# Altium schematic sheet Octal Flash.SchDoc
size A4; SheetNumber: 3; SheetTotal: 6
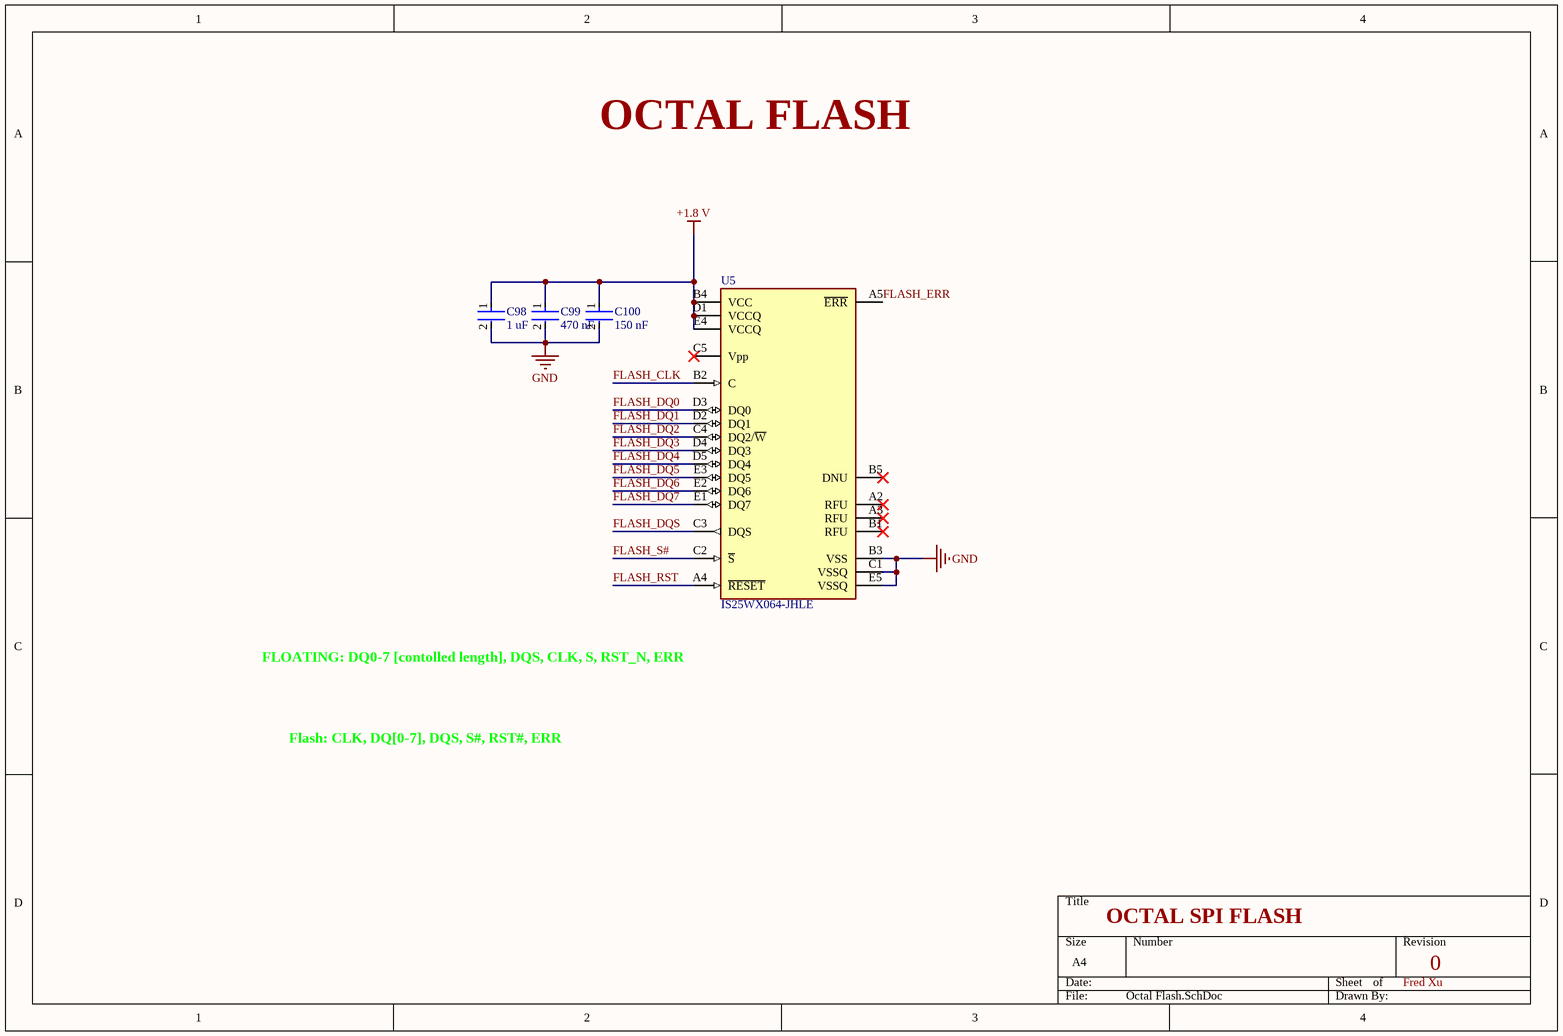
[diagram p0: Octal Flash.SchDoc]

## Parts
C98  1 uF  [FP-GCM155-0_2-MFG]
C99  470 nF  [FP-GRM155-0_05-IPC_B]
C100  150 nF  [FP-GCM155-0_05-MFG]
U5  IS25WX064-JHLE  [FP-IS25WX064-JHLE-IPC_A]

## Nets
+1.8 V: C98.1 C99.1 C100.1 U5.B4(VCC) U5.D1(VCCQ) U5.E4(VCCQ)
GND: C98.2 C99.2 C100.2 U5.B3(VSS) U5.C1(VSSQ) U5.E5(VSSQ)
FLASH_CLK: U5.B2(C)
FLASH_DQ0: U5.D3(DQ0)
FLASH_DQ1: U5.D2(DQ1)
FLASH_DQ2: U5.C4(DQ2/~{W})
FLASH_DQ3: U5.D4(DQ3)
FLASH_DQ4: U5.D5(DQ4)
FLASH_DQ5: U5.E3(DQ5)
FLASH_DQ6: U5.E2(DQ6)
FLASH_DQ7: U5.E1(DQ7)
FLASH_DQS: U5.C3(DQS)
FLASH_ERR: U5.A5(~{ERR})
FLASH_RST: U5.A4(~{RESET})
FLASH_S#: U5.C2(~{S})

Not connected (* = marked no-connect by the designer): U5 A2(RFU)* A3(RFU)* B1(RFU)* B5(DNU)* C5(Vpp)*

## Notes on the sheet
- OCTAL FLASH
- FLOATING: DQ0-7 [contolled length], DQS, CLK, S, RST_N, ERR
- Flash: CLK, DQ[0-7], DQS, S#, RST#, ERR
- OCTAL SPI FLASH
- Fred Xu
- 0

## Library data of the parts
C98 = CMP-06035-019453-1: Ceramic Capacitor for Automotive 1uF ±20% 10VDC X7S 0402 Paper T/R
C99 = CMP-06035-008909-1: Chip Multilayer Ceramic Capacitors for General Purpose, 0402, 0.47uF, X7R, 15%, 20%, 10V; Capacitance: 470nF; Length: 1mm; Thickness: 500um; Dielectric: X7R; Voltage Rating (DC): 10V; Width: 500um; Tolerance: 20%
C100 = CMP-06035-038659-1: Ceramic Capacitor for Automotive 150nF ±20% 16VDC X7R 0402 Paper T/R
U5 = CMP-00678-127855056-1: IS25WX064-JHLE Octal Flash 64Mbit 8M X 8bit SPI 1.8V 6ns 24-Pin TFBGA; Memory Size: 8MB; Max Supply Voltage: 2V; Min Supply Voltage: 1.7V; Frequency: 200MHz; Memory Type: FLASH; Ambient Temperature Range High: 105°C; NexarPartId: 127855056; Height: 1.2mm; Min Operating Temperature: -40°C; Access Time: 6ns; Max Operating Temperature: 105°C; Interface: SPI